# EasyEDA Pro project CyberryPotter-6050-v4.0.eprj, schematic RF_315
Create Date: 2024-08-04; Page Name: P1; Project Name: CyberryPotter-6050-v3.7; Schematic Name: RF_315; Update Date: 2024-08-14; Company: 嘉立创EDA; Page Size: A4; Version: V1.0
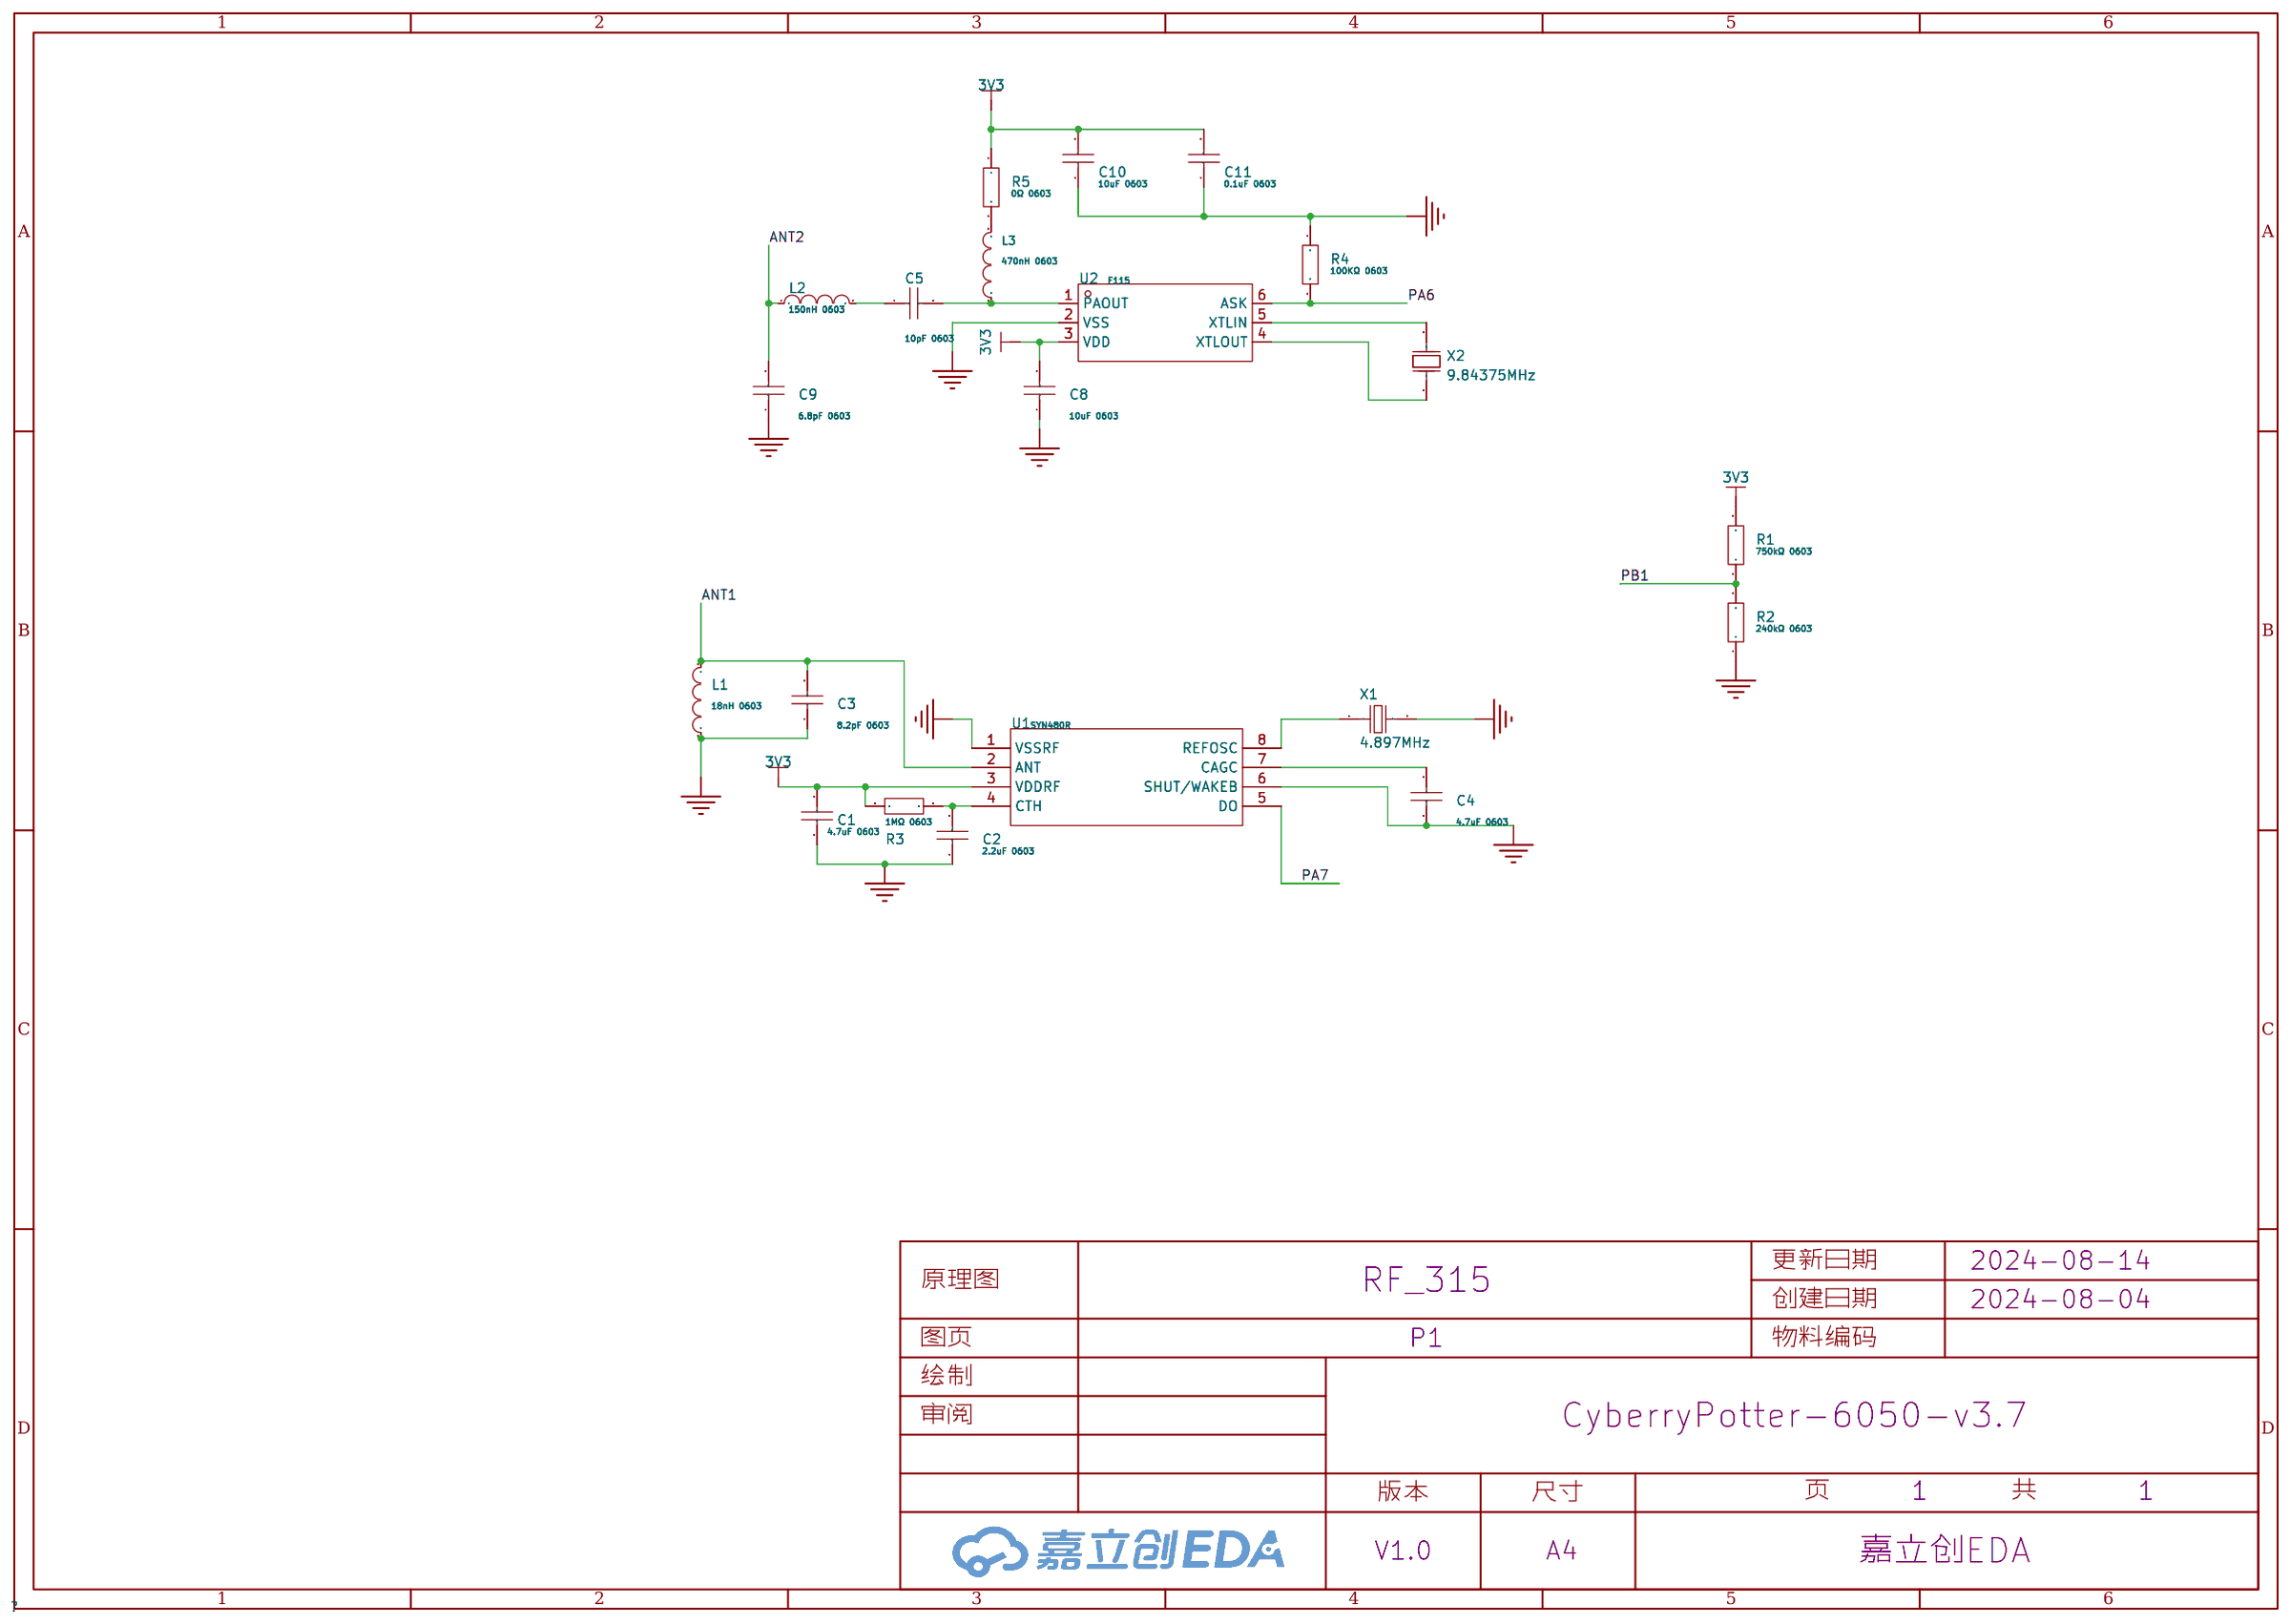
[diagram p2: schematic sheet]

## Parts
C1  4.7uF 0603  [C0603]
C2  2.2uF 0603  [C0603]
C3  8.2pF 0603  [C0603]
C4  4.7uF 0603  [C0603]
C5  10pF 0603  [C0603]
C8  10uF 0603  [C0603]
C9  6.8pF 0603  [C0603]
C10  10uF 0603  [C0603]
C11  0.1uF 0603  [C0603]
L1  18nH 0603  [L0603]
L2  150nH 0603  [L0603]
L3  470nH 0603  [L0603]
R1  750kΩ 0603  [R0603]
R2  240kΩ 0603  [R0603]
R3  1MΩ 0603  [R0603]
R4  100KΩ 0603  [R0603]
R5  0Ω 0603  [R0603]
U1  SYN480R  [SOIC-8_L5.0-W4.0-P1.27-LS6.0-BL]
U2  F115  [SOT-23-6_L2.9-W1.6-P0.95-LS2.8-BR]
X1  4.897MHz  [HC-49S_L11.0-W4.7-P4.88]
X2  9.84375MHz  [HC-49S_L11.0-W4.7-P4.88]

## Library data of the parts
C1 C2 C4 C8 C10 C11 = CL10A475KO8NNNC: 容值:4.7uF;精度:±10%;额定电压:16V;材质(温度系数):X5R;; LCSC Part Name: 4.7uF ±10% 16V; Supplier Part: C19666; Manufacturer: SAMSUNG(三星); Supplier Footprint: 0603; JLCPCB Part Class: 基础库; Datasheet: https://atta.szlcsc.com/upload/public/pdf/source/20160218/1457707763339.pdf; Supplier: LCSC; Tolerance: ±10%; Voltage Rated: 16V; Temperature Coefficient: X5R
C3 C9 = 0603CG8R2C500NT: 容值:8.2pF;额定电压:50V;材质(温度系数):C0G;; LCSC Part Name: 8.2pF 50V; Supplier Part: C1685; Manufacturer: FH(风华); Supplier Footprint: 0603; JLCPCB Part Class: 扩展库; Datasheet: https://atta.szlcsc.com/upload/public/pdf/source/20200305/C486355_26A10D38EF8C2A5C37091D0039909270.pdf; Supplier: LCSC; Voltage Rated: 50V; Temperature Coefficient: C0G
C5 = CC0603JRNPO9BN100: 容值:10pF;精度:±5%;额定电压:50V;材质(温度系数):NP0;; LCSC Part Name: 10pF ±5% 50V; Supplier Part: C106245; Manufacturer: YAGEO(国巨); Supplier Footprint: 0603; JLCPCB Part Class: 扩展库; Datasheet: https://atta.szlcsc.com/upload/public/pdf/source/20170505/1493957838062.pdf; Supplier: LCSC; Tolerance: ±5%; Voltage Rated: 50V; Temperature Coefficient: NP0
L1 = SDCL1608C18NJTDF: 电感值:18nH;精度:±5%;额定电流:300mA;饱和电流(Isat):-;直流电阻(DCR):550mΩ;; LCSC Part Name: 18nH ±5%; Supplier Part: C48590; Manufacturer: Sunlord(顺络); Supplier Footprint: 0603; JLCPCB Part Class: 扩展库; Datasheet: https://atta.szlcsc.com/upload/public/pdf/source/20231027/6126A3AAC5912C34388756BE22DEE00C.pdf; Supplier: LCSC; Tolerance: ±5%; Rated Current: 300mA; DC Resistance (DCR): 550mΩ; Q @ Freq: 12@100MHz; Frequency - Self Resonant: 2.2GHz
L2 = SCC1608C82NJSP: 电感值:82nH;精度:±5%;额定电流:300mA;饱和电流(Isat):-;直流电阻(DCR):1Ω;; LCSC Part Name: 82nH ±5%; Supplier Part: C412043; Manufacturer: Sunltech(韩国顺磁); Supplier Footprint: 0603; JLCPCB Part Class: 扩展库; Datasheet: https://atta.szlcsc.com/upload/public/pdf/source/20190819/C412052_7E47CA9107AD18C13168C896A90007C8.pdf; Supplier: LCSC; Tolerance: ±5%; Rated Current: 300mA; DC Resistance (DCR): 1Ω
L3 = LQW18ANR47G00D: 电感值:470nH;精度:±2%;额定电流:75mA;饱和电流(Isat):-;; LCSC Part Name: 470nH ±2%; Supplier Part: C113132; Manufacturer: muRata(村田); Supplier Footprint: 0603; JLCPCB Part Class: 扩展库; Datasheet: https://atta.szlcsc.com/upload/public/pdf/source/20180326/C77127_CBB089AEA7AD2ECBE76B6A055087DE79.pdf; Supplier: LCSC; Tolerance: ±2%; Rated Current: 75mA; DC Resistance (DCR): 7Ω
R1 R2 = 0603WAF1002T5E: 电阻类型:厚膜电阻;阻值:10kΩ;精度:±1%;功率:100mW;最大工作电压:75V;温度系数:±100ppm/℃;; LCSC Part Name: 厚膜电阻 10kΩ ±1% 100mW; Supplier Part: C25804; Manufacturer: UNI-ROYAL(厚声); Supplier Footprint: 0603; JLCPCB Part Class: 基础库; Datasheet: https://atta.szlcsc.com/upload/public/pdf/source/20200306/C422600_1E6D84923E4A46A82E41ADD87F860B5C.pdf; Supplier: LCSC; Type: 厚膜电阻; Tolerance: ±1%; Power(Watts): 100mW; Overload Voltage (Max): 75V; Temperature Coefficient: ±100ppm/℃; Operating Temperature Range: -55℃~+155℃
R3-R5 = 0603WAF1004T5E: 电阻类型:厚膜电阻;阻值:1MΩ;精度:±1%;功率:100mW;最大工作电压:75V;温度系数:±100ppm/℃;; LCSC Part Name: 1MΩ ±1% 100mW 厚膜电阻; Supplier Part: C22935; Manufacturer: UNI-ROYAL(厚声); Supplier Footprint: 0603; JLCPCB Part Class: 基础库; Datasheet: https://atta.szlcsc.com/upload/public/pdf/source/20200306/C422600_1E6D84923E4A46A82E41ADD87F860B5C.pdf; Supplier: LCSC; Type: 厚膜电阻; Tolerance: ±1%; Power(Watts): 100mW; Overload Voltage (Max): 75V; Temperature Coefficient: ±100ppm/℃; Operating Temperature Range: -55℃~+155℃
U1 = SYN480R_C15561: 原：SYN480R-FS24; LCSC Part Name: 单片ASK/OOK射频接收器IC; Supplier Part: C15561; Manufacturer: Synoxo; Supplier Footprint: SOIC-8; JLCPCB Part Class: 扩展库; Supplier: LCSC
U2 = F115: Supplier Part: C3010244; Manufacturer: Synoxo; Supplier Footprint: SOT-23-6; JLCPCB Part Class: 扩展库; Datasheet: https://atta.szlcsc.com/upload/public/pdf/source/20220518/DB87B9C28F482D3C116CF55472C82304.pdf; Supplier: LCSC
X1 = LOPAD04897U11L: 晶振类型:插件晶振;频率:4.897MHz;常温频差:±20ppm;外接负载电容:20pF;; LCSC Part Name: 4.897MHz ±20ppm 20pF; Supplier Part: C5344964; Manufacturer: Lucki(蓝晶); Supplier Footprint: HC-49S; JLCPCB Part Class: 扩展库; Datasheet: https://atta.szlcsc.com/upload/public/pdf/source/20221230/8CBEB3BF614E139FDE5D5FC9BB224CE3.pdf; Supplier: LCSC; Crystal Type: 插件晶振; Normal temperature Frequency Tolerance: ±20ppm; External load capacitor: 20pF; Operating Temperature: -40℃~+85℃
X2 = 9AC98437182080: 晶振类型:直插晶振;频率:9.84375MHz;常温频差:±20ppm;外接负载电容:20pF;; LCSC Part Name: 9.84375MHz ±20ppm 20pF; Supplier Part: C1508965; Manufacturer: JGHC(晶光华); Supplier Footprint: HC-49S; JLCPCB Part Class: 扩展库; Datasheet: https://atta.szlcsc.com/upload/public/pdf/source/20210105/C1508965_D7120E964E1F1AA3FF0DC91E675C06C8.pdf; Supplier: LCSC; Crystal Type: 直插晶振; Normal temperature Frequency Tolerance: ±20ppm; External load capacitor: 20pF; Equivalent Series Resistance (ESR): 80Ω; Operating Temperature: -40℃~+85℃

## Nets
3V3: C1.1 C8.2 C10.2 C11.2 R1.2 R3.2 R5.1 U1.3(VDDRF) U2.3(VDD)
GND: C1.2 C2.1 C3.1 C4.1 C8.1 C9.1 C10.1 C11.1 L1.1 R2.1 R4.1 U1.1(VSSRF) U1.6(SHUT/WAKEB) U2.2(VSS) X1.2
ANT1: C3.2 L1.2 U1.2(ANT)
ANT2: C9.2 L2.1
PA6: R4.2 U2.6(ASK)
PA7: U1.5(DO)
PB1: R1.1 R2.2
$1N1077: C2.2 R3.1 U1.4(CTH)
$1N1101: U1.8(REFOSC) X1.1
$1N1103: C4.2 U1.7(CAGC)
$1N1114: C5.2 L3.1 U2.1(PAOUT)
$1N1117: C5.1 L2.2
$1N5451: L3.2 R5.2
$1N7729: U2.5(XTLIN) X2.2(OSC2)
$1N7737: U2.4(XTLOUT) X2.1(OSC1)
